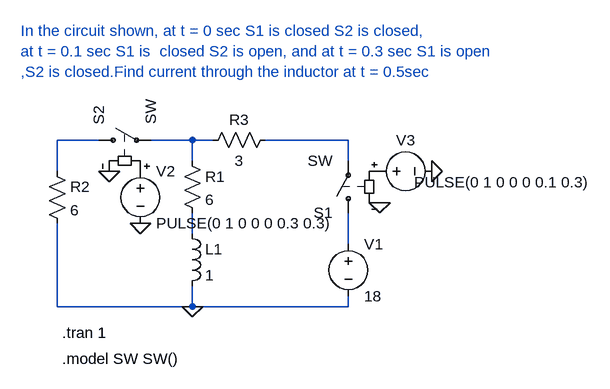
[diagram p0: schematic Lab4_ques5.asc]
Lab4_ques5.asc, the LTspice schematic file:
Version 4
SHEET 1 880 680
WIRE 64 240 0 240
WIRE 208 240 144 240
WIRE 240 240 208 240
WIRE 448 240 320 240
WIRE 208 272 208 240
WIRE 448 272 448 240
WIRE 0 288 0 240
WIRE 208 384 208 352
WIRE 448 400 448 352
WIRE 0 496 0 368
WIRE 208 496 208 464
WIRE 208 496 0 496
WIRE 448 496 448 480
WIRE 448 496 208 496
FLAG 80 288 0
FLAG 496 336 0
FLAG 576 288 0
FLAG 128 368 0
FLAG 208 496 0
SYMBOL Res 192 256 R0
SYMATTR InstName R1
SYMATTR Value 6
SYMBOL Res -16 272 R0
SYMATTR InstName R2
SYMATTR Value 6
SYMBOL Res 336 224 R90
WINDOW 0 0 56 VBottom 2
WINDOW 3 32 56 VTop 2
SYMATTR InstName R3
SYMATTR Value 3
SYMBOL Voltage 448 384 R0
SYMATTR InstName V1
SYMATTR Value 18
SYMBOL ind 192 368 R0
SYMATTR InstName L1
SYMATTR Value 1
SYMBOL sw 448 368 R180
SYMATTR InstName S1
SYMBOL sw 48 240 R270
SYMATTR InstName S2
SYMBOL Voltage 128 272 R0
SYMATTR InstName V2
SYMATTR Value PULSE(0 1 0 0 0 0.3 0.3)
SYMBOL Voltage 480 288 R270
WINDOW 0 32 56 VTop 2
WINDOW 3 -1 204 VBottom 2
SYMATTR InstName V3
SYMATTR Value PULSE(0 1 0 0 0 0.1 0.3)
TEXT -56 72 Left 2 ;In the circuit shown, at t = 0 sec S1 is closed S2 is closed,\nat t = 0.1 sec S1 is  closed S2 is open, and at t = 0.3 sec S1 is open\n,S2 is closed.Find current through the inductor at t = 0.5sec
TEXT 8 536 Left 2 !.tran 1
TEXT 8 576 Left 2 !.model SW SW()

The netlist it stands for:
* Lab4_ques5.asc
R1 N002 N004 6
R2 N001 0 6
R3 N003 N002 3
V1 N005 0 18
L1 N004 0 1
S1 N005 N003 P001 0 SW
S2 N001 N002 P002 0 SW
V2 P002 0 PULSE(0 1 0 0 0 0.3 0.3)
V3 P001 0 PULSE(0 1 0 0 0 0.1 0.3)
* In the circuit shown, at t = 0 sec S1 is closed S2 is closed,
* at t = 0.1 sec S1 is  closed S2 is open, and at t = 0.3 sec S1 is open
* ,S2 is closed.Find current through the inductor at t = 0.5sec
.tran 1
.model SW SW()
.backanno
.end